# Altium schematic sheet output.SchDoc
size A
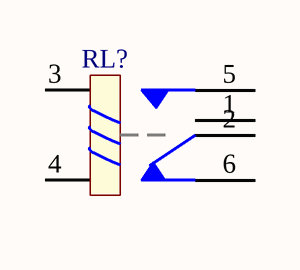
[diagram p0: output.SchDoc]

## Parts
RL?  (no value)  [RL-HK4100F]

## Nets

Not connected (* = marked no-connect by the designer): RL? 1 2 3 4 5 6

## Library data of the parts
RL? = RL-HK4100F: Relay SPDT,10A - 12VDC 5 Pin; Coil: Relay DC12V